# Altium schematic sheet HydrophoneGroup1FilterAndAmpCircuit.SchDoc
size C
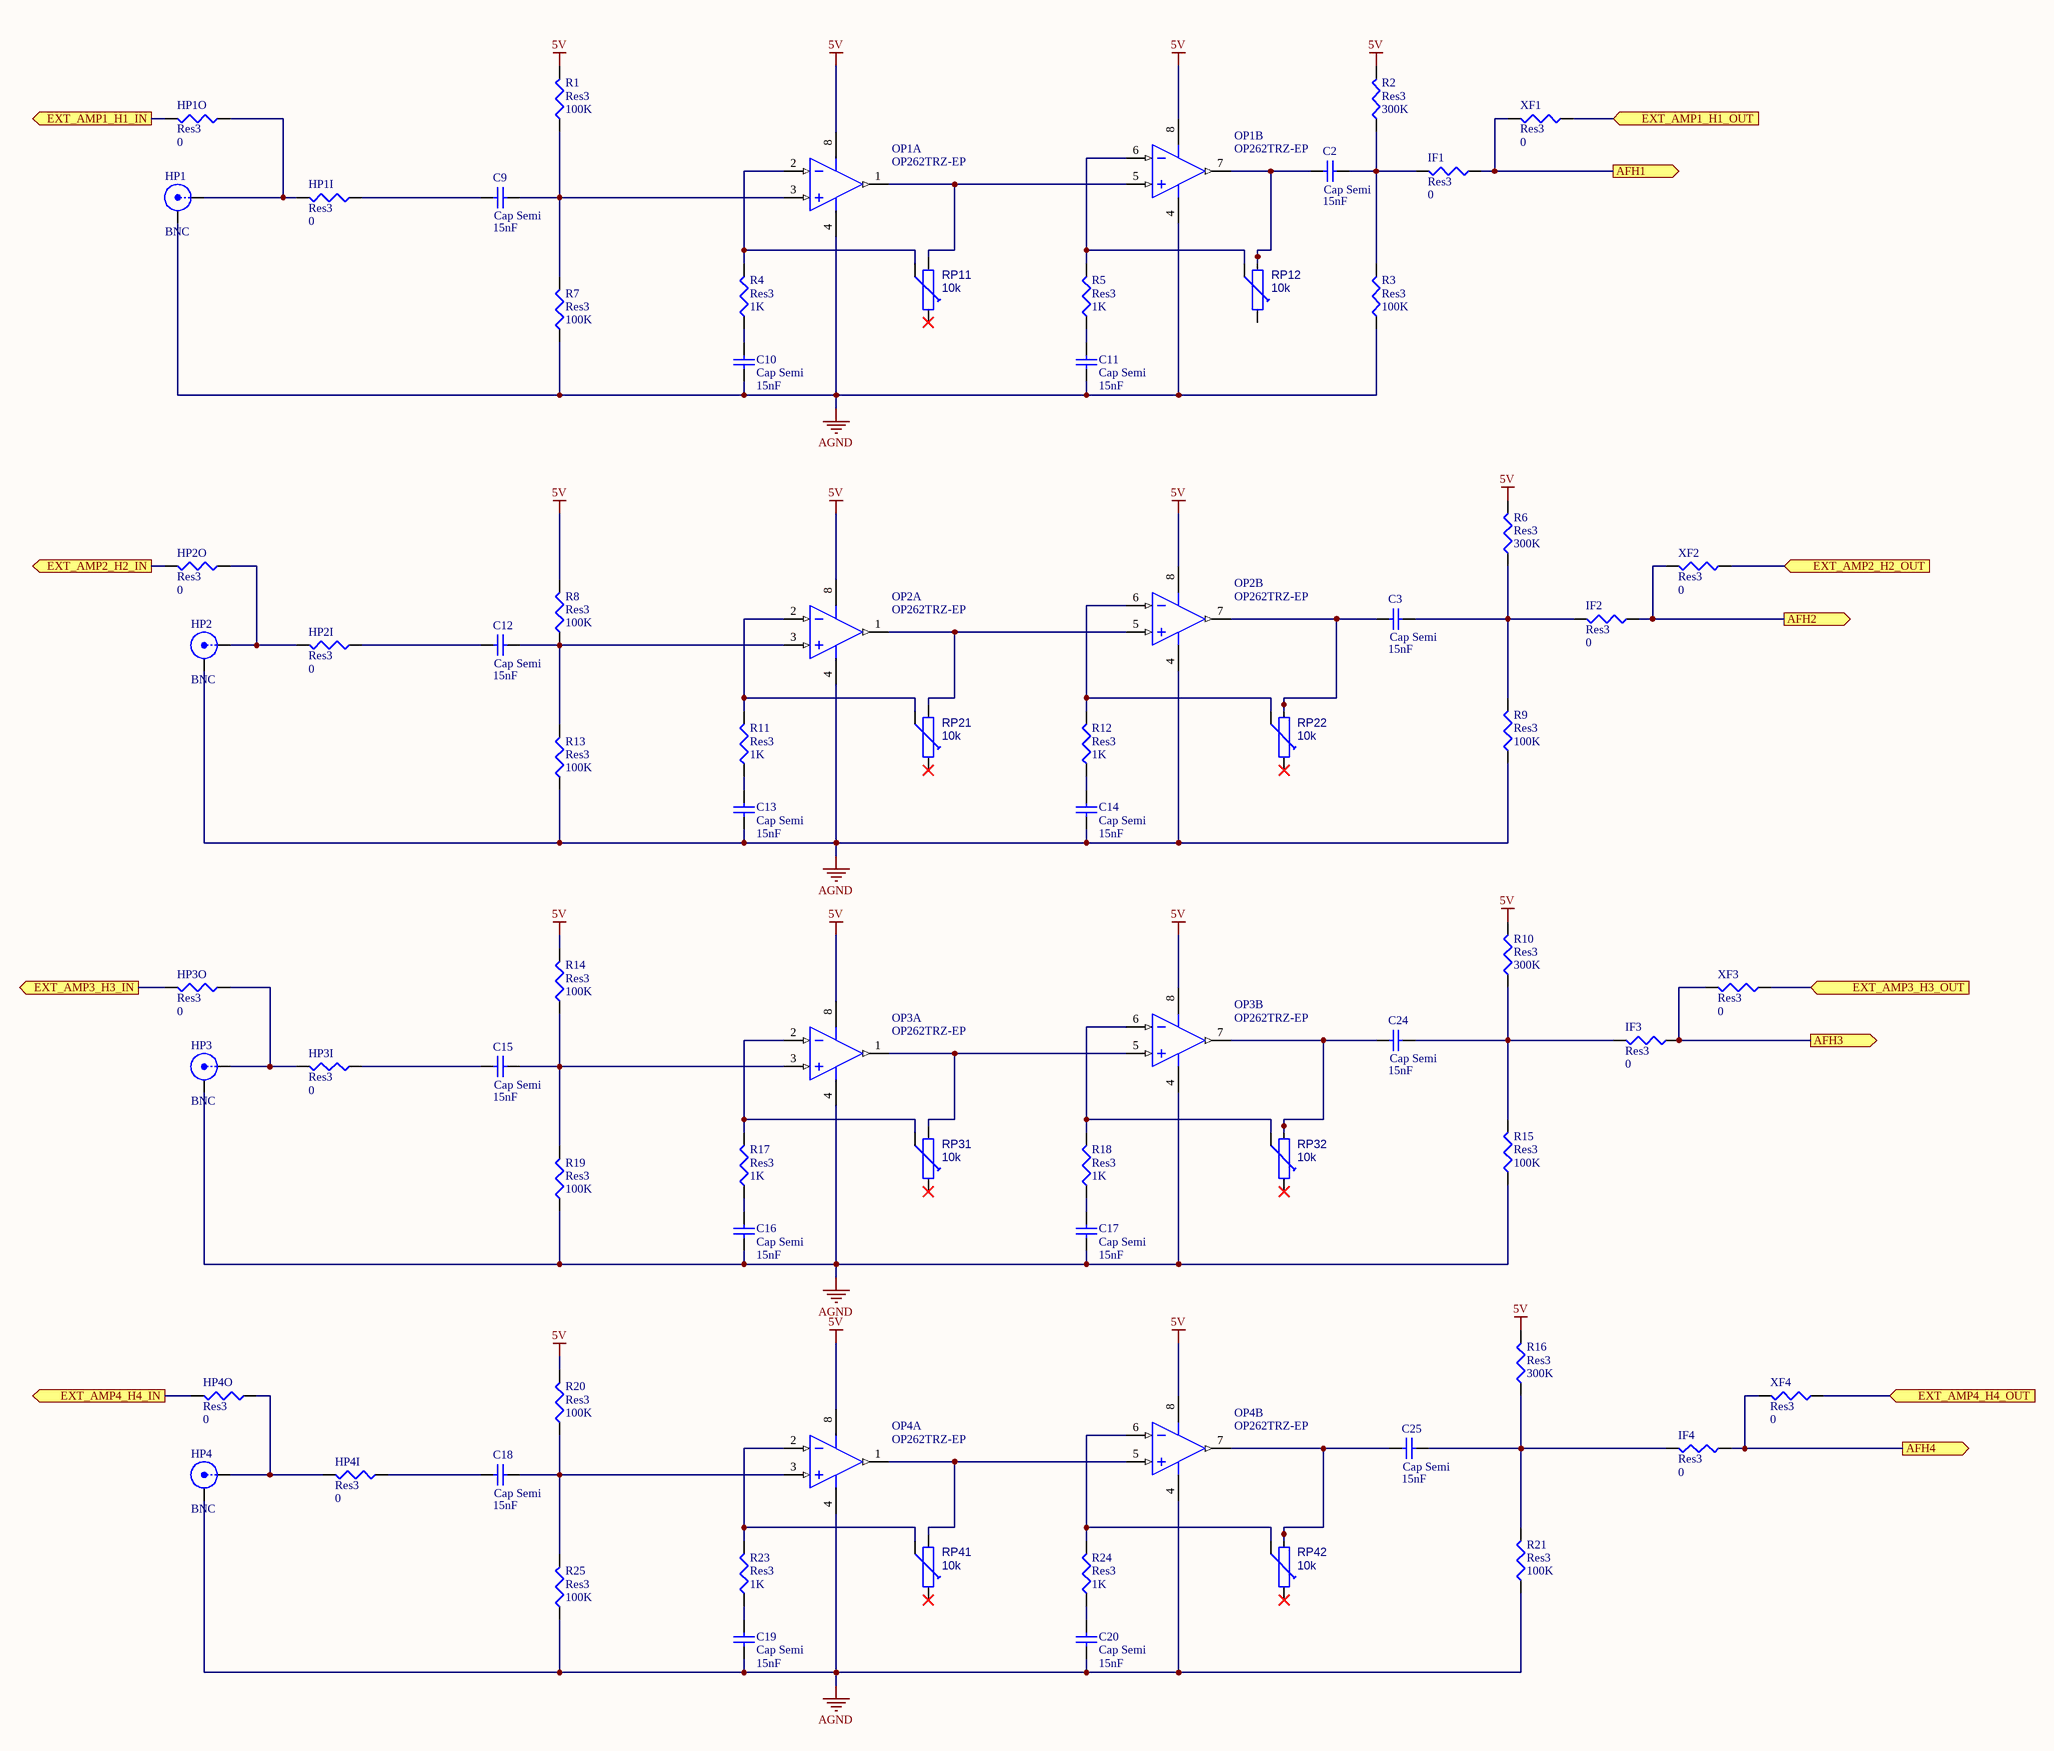
[diagram p0: HydrophoneGroup1FilterAndAmpCircuit.SchDoc]

## Parts
C2  Cap Semi  value 15nF  [C0805]
C3  Cap Semi  value 15nF  [C0805]
C9  Cap Semi  value 15nF  [C0805]
C10  Cap Semi  value 15nF  [C0805]
C11  Cap Semi  value 15nF  [C0805]
C12  Cap Semi  value 15nF  [C0805]
C13  Cap Semi  value 15nF  [C0805]
C14  Cap Semi  value 15nF  [C0805]
C15  Cap Semi  value 15nF  [C0805]
C16  Cap Semi  value 15nF  [C0805]
C17  Cap Semi  value 15nF  [C0805]
C18  Cap Semi  value 15nF  [C0805]
C19  Cap Semi  value 15nF  [C0805]
C20  Cap Semi  value 15nF  [C0805]
C24  Cap Semi  value 15nF  [C0805]
C25  Cap Semi  value 15nF  [C0805]
HP1  BNC  [BNC_RA CON]
HP1I  Res3  value 0  [J1-0603]
HP1O  Res3  value 0  [J1-0603]
HP2  BNC  [BNC_RA CON]
HP2I  Res3  value 0  [J1-0603]
HP2O  Res3  value 0  [J1-0603]
HP3  BNC  [BNC_RA CON]
HP3I  Res3  value 0  [J1-0603]
HP3O  Res3  value 0  [J1-0603]
HP4  BNC  [BNC_RA CON]
HP4I  Res3  value 0  [J1-0603]
HP4O  Res3  value 0  [J1-0603]
IF1  Res3  value 0  [J1-0603]
IF2  Res3  value 0  [J1-0603]
IF3  Res3  value 0  [J1-0603]
IF4  Res3  value 0  [J1-0603]
OP1  OP262TRZ-EP  [ADI-R-8_N]  (parts A,B of 2)
OP2  OP262TRZ-EP  [ADI-R-8_N]  (parts A,B of 2)
OP3  OP262TRZ-EP  [ADI-R-8_N]  (parts A,B of 2)
OP4  OP262TRZ-EP  [ADI-R-8_N]  (parts A,B of 2)
R1  Res3  value 100K  [J1-0603]
R2  Res3  value 300K  [J1-0603]
R3  Res3  value 100K  [J1-0603]
R4  Res3  value 1K  [J1-0603]
R5  Res3  value 1K  [J1-0603]
R6  Res3  value 300K  [J1-0603]
R7  Res3  value 100K  [J1-0603]
R8  Res3  value 100K  [J1-0603]
R9  Res3  value 100K  [J1-0603]
R10  Res3  value 300K  [J1-0603]
R11  Res3  value 1K  [J1-0603]
R12  Res3  value 1K  [J1-0603]
R13  Res3  value 100K  [J1-0603]
R14  Res3  value 100K  [J1-0603]
R15  Res3  value 100K  [J1-0603]
R16  Res3  value 300K  [J1-0603]
R17  Res3  value 1K  [J1-0603]
R18  Res3  value 1K  [J1-0603]
R19  Res3  value 100K  [J1-0603]
R20  Res3  value 100K  [J1-0603]
R21  Res3  value 100K  [J1-0603]
R23  Res3  value 1K  [J1-0603]
R24  Res3  value 1K  [J1-0603]
R25  Res3  value 100K  [J1-0603]
RP11  10k  [Trim_Bourns3296]
RP12  10k  [Trim_Bourns3296]
RP21  10k  [Trim_Bourns3296]
RP22  10k  [Trim_Bourns3296]
RP31  10k  [Trim_Bourns3296]
RP32  10k  [Trim_Bourns3296]
RP41  10k  [Trim_Bourns3296]
RP42  10k  [Trim_Bourns3296]
XF1  Res3  value 0  [J1-0603]
XF2  Res3  value 0  [J1-0603]
XF3  Res3  value 0  [J1-0603]
XF4  Res3  value 0  [J1-0603]

## Ports
AFH1 (out), AFH2 (out), AFH3 (out), AFH4 (out), EXT_AMP1_H1_IN (out), EXT_AMP1_H1_OUT (in), EXT_AMP2_H2_IN (out), EXT_AMP2_H2_OUT (in), EXT_AMP3_H3_IN (out), EXT_AMP3_H3_OUT (in), EXT_AMP4_H4_IN (out), EXT_AMP4_H4_OUT (in)

## Nets
5V: OP1.8(+V) OP2.8(+V) OP3.8(+V) OP4.8(+V) R1.2 R2.2 R6.2 R8.2 R10.2 R14.2 R16.2 R20.2
AGND: C10.1 C11.1 C13.1 C14.1 C16.1 C17.1 C19.1 C20.1 HP1.2(Y) HP2.2(Y) HP3.2(Y) HP4.2(Y) OP1.4(-V) OP2.4(-V) OP3.4(-V) OP4.4(-V) R3.1 R7.1 R9.1 R13.1 R15.1 R19.1 R21.1 R25.1
AFH1: IF1.1 XF1.2 ; port AFH1
AFH2: IF2.1 XF2.2 ; port AFH2
AFH3: IF3.1 XF3.2 ; port AFH3
AFH4: IF4.1 XF4.2 ; port AFH4
EXT_AMP1_H1_IN: HP1O.2 ; port EXT_AMP1_H1_IN
EXT_AMP1_H1_OUT: XF1.1 ; port EXT_AMP1_H1_OUT
EXT_AMP2_H2_IN: HP2O.2 ; port EXT_AMP2_H2_IN
EXT_AMP2_H2_OUT: XF2.1 ; port EXT_AMP2_H2_OUT
EXT_AMP3_H3_IN: HP3O.2 ; port EXT_AMP3_H3_IN
EXT_AMP3_H3_OUT: XF3.1 ; port EXT_AMP3_H3_OUT
EXT_AMP4_H4_IN: HP4O.2 ; port EXT_AMP4_H4_IN
EXT_AMP4_H4_OUT: XF4.1 ; port EXT_AMP4_H4_OUT
NetC2_1: C2.1 OP1.7(OUT_B) RP12.1
NetC2_2: C2.2 IF1.2 R2.1 R3.2
NetC3_1: C3.1 OP2.7(OUT_B) RP22.1
NetC3_2: C3.2 IF2.2 R6.1 R9.2
NetC9_1: C9.1 HP1I.1
NetC9_2: C9.2 OP1.3(+IN_A) R1.1 R7.2
NetC10_2: C10.2 R4.1
NetC11_2: C11.2 R5.1
NetC12_1: C12.1 HP2I.1
NetC12_2: C12.2 OP2.3(+IN_A) R8.1 R13.2
NetC13_2: C13.2 R11.1
NetC14_2: C14.2 R12.1
NetC15_1: C15.1 HP3I.1
NetC15_2: C15.2 OP3.3(+IN_A) R14.1 R19.2
NetC16_2: C16.2 R17.1
NetC17_2: C17.2 R18.1
NetC18_1: C18.1 HP4I.1
NetC18_2: C18.2 OP4.3(+IN_A) R20.1 R25.2
NetC19_2: C19.2 R23.1
NetC20_2: C20.2 R24.1
NetC24_1: C24.1 OP3.7(OUT_B) RP32.1
NetC24_2: C24.2 IF3.2 R10.1 R15.2
NetC25_1: C25.1 OP4.7(OUT_B) RP42.1
NetC25_2: C25.2 IF4.2 R16.1 R21.2
NetHP1_1: HP1.1(X) HP1I.2 HP1O.1
NetHP2_1: HP2.1(X) HP2I.2 HP2O.1
NetHP3_1: HP3.1(X) HP3I.2 HP3O.1
NetHP4_1: HP4.1(X) HP4I.2 HP4O.1
NetOP1_1: OP1.1(OUT_A) OP1.5(+IN_B) RP11.1
NetOP1_2: OP1.2(-IN_A) R4.2 RP11.2
NetOP1_6: OP1.6(-IN_B) R5.2 RP12.2
NetOP2_1: OP2.1(OUT_A) OP2.5(+IN_B) RP21.1
NetOP2_2: OP2.2(-IN_A) R11.2 RP21.2
NetOP2_6: OP2.6(-IN_B) R12.2 RP22.2
NetOP3_1: OP3.1(OUT_A) OP3.5(+IN_B) RP31.1
NetOP3_2: OP3.2(-IN_A) R17.2 RP31.2
NetOP3_6: OP3.6(-IN_B) R18.2 RP32.2
NetOP4_1: OP4.1(OUT_A) OP4.5(+IN_B) RP41.1
NetOP4_2: OP4.2(-IN_A) R23.2 RP41.2
NetOP4_6: OP4.6(-IN_B) R24.2 RP42.2

Not connected (* = marked no-connect by the designer): RP11 3*; RP12 3; RP21 3*; RP22 3*; RP31 3*; RP32 3*; RP41 3*; RP42 3*

## Library data of the parts
C2 C3 C9-C20 C24 C25 = Cap Semi: Capacitor (Semiconductor SIM Model); Published: 8-Jun-2000; LatestRevisionDate: 29-May-2009; LatestRevisionNote: IPC-7351 Footprint Added.; PackageReference: C1206; Publisher: Altium Limited; PackageDescription: Chip Capacitor
HP1-HP4 = BNC: BNC Elbow Connector; LatestRevisionDate: 17-Jul-2002; LatestRevisionNote: Re-released for DXP Platform.; Publisher: Altium Limited
HP1I HP1O HP2I HP2O HP3I HP3O HP4I HP4O IF1-IF4 R1-R21 R23-R25 XF1-XF4 = Res3: Resistor; Published: 8-Jun-2000; LatestRevisionDate: 29-May-2009; LatestRevisionNote: IPC-7351 Footprint Added.; PackageReference: J1-0603; Publisher: Altium Limited; PackageDescription: Chip Resistor
OP1-OP4 = OP262TRZ-EP: Double Channel Wide Bandwidth Operational Amplifier, 15 MHz BW, 13 V/us SR, Military, 8-pin SOIC (R-8), Tube; Generic Part Number: OP262; Manufacturer: Analog Devices; Amplifiers Per Package: 2; Input Bias Current: 260nA; Input Offset Voltage: 25uV; Iq/Amp: 775uA; Slew Rate: 13V/us; Small Signal Bandwidth: 15MHz; V Span Max: 12V; V Span Min: 2.7V; DatasheetVersion: Rev. G; PackageVersion: 060506-A; PackageReference: R-8; PackageDescription: 8-Pin Standard Small Outline Package, Body 3.9 x 4.9 mm, Pitch 1.27 mm; Supplier 1: Digi-Key; Supplier Part Number 1: OP262TRZ-EP-ND; Supplier 2: Newark; Supplier Part Number 2: 85R9009; Packing: Tube; Mounting Technology: Surface Mount; Code_JEDEC: MS-012-AA; PartNumber: OP262TRZ-EP; ComponentLink1Description: Manufacturer URL; ComponentLink1URL: http://www.analog.com/en/index.html; ComponentLink2Description: Datasheet; ComponentLink2URL: http://www.analog.com/static/imported-files/data_sheets/OP162_262_462.pdf; ComponentLink3Description: Package Specification; ComponentLink3URL: http://www.analog.com/static/imported-files/packages/PKG_PDF/SOIC_Narrow%20(R)/R_8.pdf
RP11 RP12 RP21 RP22 RP31 RP32 RP41 RP42 = RES_Trim: Resistor Trimmer; Part_Number: RES_Trim_Bourns3296; Part Description: Trimmer, Bourns 3296 0.5W; Mfr Part Number: Bourns 3296Y-1-xxxLF; Validated: False; Value: 10k; Type: RES; Distributor info: RS 3296Y-1-xxxLF (1k=3296Y-1-102LF); Price: 2,03; ComponentLink1Description: Manufacturer; ComponentLink1URL: http://bourns.de/; Creation Date: 05.12.2011; IPC: False